# EAGLE design I2C Puppet (EAGLE 9.4.2)
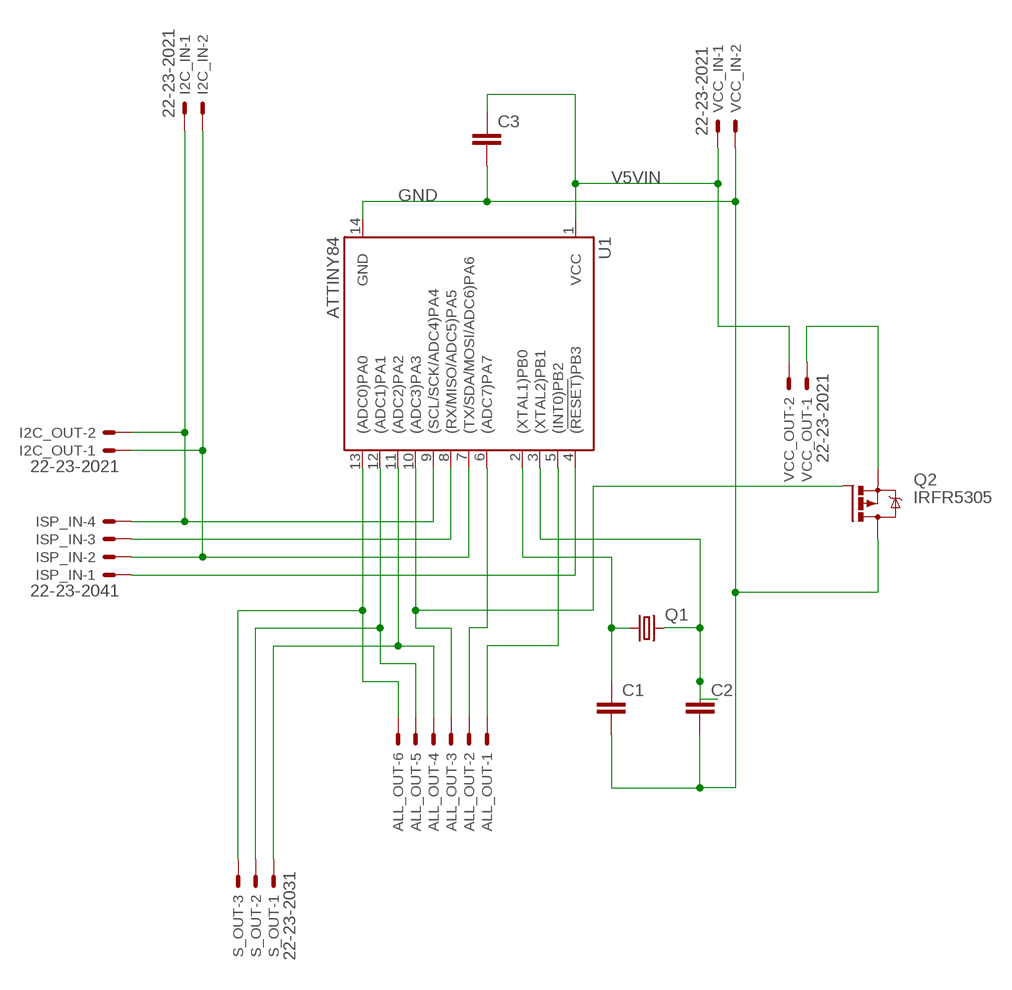
[diagram p0: schematic, sheet 1]

## Parts
ALL_OUT  22-23-2061  [22-23-2061]
C1  C-EUC1210  [C1210]
C2  C-EUC1210  [C1210]
C3  C-EUC1210  [C1210]
I2C_IN  22-23-2021  [22-23-2021]
I2C_OUT  22-23-2021  [22-23-2021]
ISP_IN  22-23-2041  [22-23-2041]
Q1  CRYSTALHC49UP  [HC49UP]
Q2  IRFR5305  [D-PAK_TO252AA]
S_OUT  22-23-2031  [22-23-2031]
U1  ATTINY84  [SO14]
VCC_IN  22-23-2021  [22-23-2021]
VCC_OUT  22-23-2021  [22-23-2021]

## Nets
GND: C1.2 C2.2 C3.2 Q2.4(D) U1.14(GND) VCC_IN.2
N$2: ALL_OUT.4 S_OUT.1 U1.11((ADC2)PA2)
N$3: I2C_IN.1 I2C_OUT.2 ISP_IN.4 U1.9((SCL/SCK/ADC4)PA4)
N$4: I2C_IN.2 I2C_OUT.1 ISP_IN.2 U1.7((TX/SDA/MOSI/ADC6)PA6)
N$5: C1.1 Q1.1 U1.2((XTAL1)PB0)
N$6: C2.1 Q1.2 U1.3((XTAL2)PB1)
N$7: ISP_IN.1 U1.4((!RESET!)PB3)
N$8: Q2.3(S) VCC_OUT.1
N$9: ISP_IN.3 U1.8((RX/MISO/ADC5)PA5)
N$11: ALL_OUT.6 S_OUT.3 U1.13((ADC0)PA0)
N$12: ALL_OUT.5 S_OUT.2 U1.12((ADC1)PA1)
N$13: ALL_OUT.3 Q2.1(G) U1.10((ADC3)PA3)
N$15: ALL_OUT.2 U1.6((ADC7)PA7)
N$16: ALL_OUT.1 U1.5((INT0)PB2)
V5VIN: C3.1 U1.1(VCC) VCC_IN.1 VCC_OUT.2

## Library data of the parts
ALL_OUT = con-molex:22-23-2061: .100" (2.54mm) Center Header - 6 Pin; MF: MOLEX; MPN: 22-23-2061; OC_FARNELL: 1462922; OC_NEWARK: 27C1933
C1-C3 = rcl:C-EU: CAPACITOR, European symbol; SPICEPREFIX: C
I2C_IN I2C_OUT VCC_IN VCC_OUT = con-molex:22-23-2021: .100" (2.54mm) Center Header - 2 Pin; MF: MOLEX; MPN: 22-23-2021; OC_FARNELL: 1462926; OC_NEWARK: 25C3832
ISP_IN = con-molex:22-23-2041: .100" (2.54mm) Center Header - 4 Pin; MF: MOLEX; MPN: 22-23-2041; OC_FARNELL: 1462920; OC_NEWARK: 38C0355
Q1 = adafruit:CRYSTAL: CRYSTAL; OC_FARNELL: unknown; OC_NEWARK: unknown
Q2 = transistor-power:IRF?5305: HEXFET Power MOSFET Source: http://www.irf.com/product-info/datasheets/data/irfr5305pbf.pdf
S_OUT = con-molex:22-23-2031: .100" (2.54mm) Center Header - 3 Pin; MF: MOLEX; MPN: 22-23-2031; OC_FARNELL: 1462950; OC_NEWARK: 30C0862
U1 = SparkFun-IC-Microcontroller:ATTINY84: Atmel 14-pin 2/4/8kB flash uC Datasheet <https://cdn.sparkfun.com/datasheets/Widgets/doc8006.pdf> SparkFun Products Tiny AVR Programmer <https://www.sparkfun.com/products/11801> (PGM-11801) SparkFun Servo Trigger - Continuous Rotation <https://www.sparkfun.com/products/13872> (WIG-13872) SparkFun Servo Trigger <https://www.sparkfun.com/products/13118> (WIG-13118); PROD_ID: IC-11285

## Board
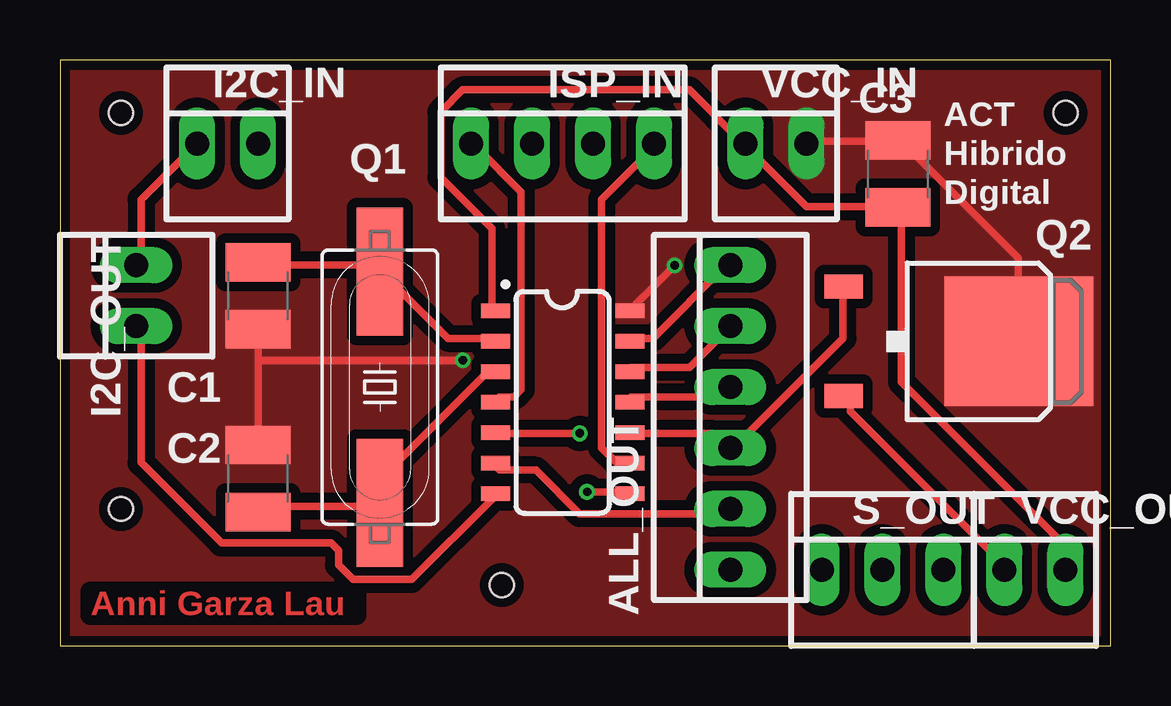
[diagram p1: board, top side]
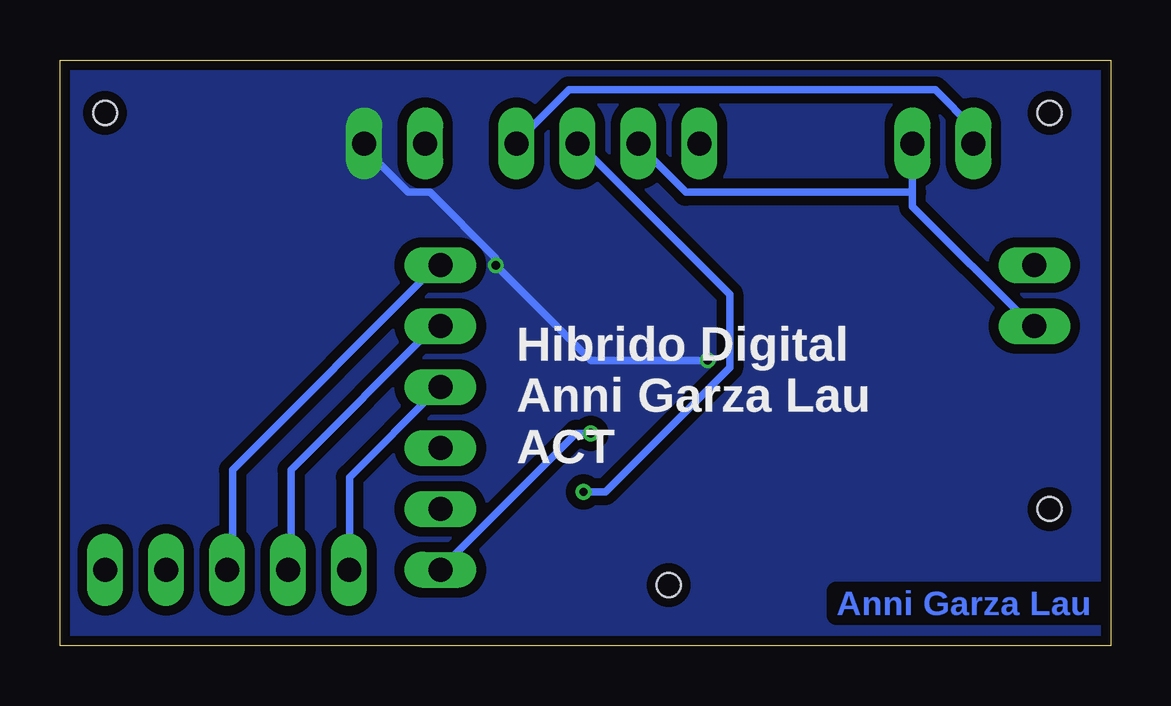
[diagram p2: board, bottom side, seen from below]

Size 43.8 x 24.43 mm. Coordinates in mm from the lower left corner, seen from the top.
Outline: 0,0 43.8,0 43.8,24.43 0,24.43 0,0
Copper layers (1*16): Top 0.035mm / dielectric 1.5mm / Bottom 0.035mm
Design rules "_xircuitos.mx_2L_DRC": minimum track width 6mil, minimum drill 12mil, track to track 6mil, track to pad 6mil, pad to pad 6mil, via to via 6mil, smd to smd 0mil, copper to edge 10mil, drill to drill 12mil, minimum pad ring 10mil, minimum via ring 6mil, stop-mask expansion 2mil, vias tented up to drill 100mil, thermal gap 10mil
Holes 1 mm at 2.54,22.23 41.91,22.23 18.41,2.54 2.54,5.71

### Footprints (pad centres in the part's own frame; a part is rotated, then mirrored left to right if it is on the bottom)
22-23-2061 = drill 1 long: 1 -6.35,0; 2 -3.81,0; 3 -1.27,0; 4 1.27,0; 5 3.81,0; 6 6.35,0
C1210 = smd 1.6 x 2.7: 1 -1.4,0; 2 1.4,0
22-23-2021 = drill 1 long: 1 -1.27,0; 2 1.27,0
22-23-2041 = drill 1 long: 1 -3.81,0; 2 -1.27,0; 3 1.27,0; 4 3.81,0
HC49UP = smd 5.334 x 1.93: 1 -4.826,0; 2 4.826,0
D-PAK_TO252AA = smd 1 x 1.6: 1 -2.28,-4.8; 3 2.28,-4.8 | smd 5.4 x 6.2: 4 0,2.5
22-23-2031 = drill 1 long: 1 -2.54,0; 2 0,0; 3 2.54,0
SO14 = smd 0.6 x 1.2: 1 -3.175,-2.8; 2 -1.905,-2.8; 3 -0.635,-2.8; 4 0.635,-2.8; 5 1.905,-2.8; 6 3.175,-2.8; 7 4.445,-2.8; 8 4.445,2.8; 9 3.175,2.8; 10 1.905,2.8; 11 0.635,2.8; 12 -0.635,2.8; 13 -1.905,2.8; 14 -3.175,2.8

### Placement (x,y rotation side)
ALL_OUT  27.94,9.53 90 top
C1  8.26,14.61 270 top
C2  8.26,6.99 90 top
C3  34.92,19.68 90 top
I2C_IN  6.99,20.95 0 top
I2C_OUT  3.17,14.61 90 top
ISP_IN  20.95,20.95 0 top
Q1  13.34,10.79 270 top
Q2  37.47,12.7 270 top
S_OUT  34.29,3.17 0 top
U1  20.95,10.79 270 top
VCC_IN  29.84,20.95 0 top
VCC_OUT  40.64,3.17 0 top

### Tracks (layer width: path | path; a pad name or v marks a point on that pad's centre or on a via)
GND  (via drill 0.35)
  Top 0.305: C1.2 8.26,11.91 | 8.26,11.91 C2.2 | v25.63,15.88 23.8,14.05 U1.14 | VCC_IN.2 31.11,21.06 34.77,21.06 C3.2 35.08,21.06 39.95,16.18 39.95,12.83 Q2.4 | v16.79,11.91 8.26,11.91
  Bottom 0.305: VCC_IN.2 31.11,20.75 29.29,18.92 28.37,18.92 25.63,16.18 v25.63,15.88 21.67,11.91 v16.79,11.91
  pour Bottom (isolate 0.406, no thermals): 0,0 43.81,0 43.81,24.77 0,24.77
  pour Top (isolate 0.406, no thermals): 0,0 0,24.77 43.81,24.77 43.81,0
N$2
  Top 0.305: U1.11 23.8,10.39 27.46,10.39 27.76,10.69 ALL_OUT.4
  Bottom 0.305: S_OUT.1 31.73,3.38 31.73,7.04 28.07,10.69 ALL_OUT.4
N$3
  Top 0.305: I2C_IN.1 3.38,18.62 3.38,15.88 I2C_OUT.2 | U1.9 23.5,7.64 23.19,7.64 22.58,8.26 22.58,18.62 24.71,20.75 ISP_IN.4
  Bottom 0.305: I2C_IN.1 5.71,21.59 7.32,23.19 22.58,23.19 24.71,21.06 ISP_IN.4
N$4
  Top 0.305: U1.7 18.01,6.12 14.66,2.77 12.22,2.77 11.61,3.38 11.61,3.99 11.3,4.29 6.73,4.29 3.38,7.64 3.38,13.13 I2C_OUT.1
  Bottom 0.305: 8.26,18.92 8.26,18.31 3.38,13.44 I2C_OUT.1 | 8.26,18.92 I2C_IN.2 | 8.26,18.92 17.7,18.92 19.53,20.75 ISP_IN.2
N$5
  Top 0.305: U1.2 18.01,12.83 16.18,12.83 13.44,15.57 Q1.1 13.13,15.88 8.26,15.88 C1.1
N$6
  Top 0.305: U1.3 18.01,11.3 17.7,11.3 13.44,7.04 13.44,6.12 Q1.2 13.13,5.82 8.26,5.82 C2.1
N$7
  Top 0.305: U1.4 18.31,10.39 18.92,10.39 19.23,10.69 19.23,18.92 17.4,20.75 ISP_IN.1
N$8
  Top 0.305: Q2.3 32.94,10.39 32.94,9.78 39.34,3.38 VCC_OUT.1
N$9  (via drill 0.35)
  Top 0.305: v21.97,6.43 23.5,6.43 U1.8
  Bottom 0.305: v21.97,6.43 21.06,6.43 15.88,11.61 15.88,14.66 21.97,20.75 ISP_IN.3
N$11
  Top 0.305: U1.13 23.8,12.83 24.71,12.83 27.76,15.88 ALL_OUT.6
  Bottom 0.305: S_OUT.3 36.6,3.38 36.6,7.34 28.07,15.88 ALL_OUT.6
N$12
  Top 0.305: U1.12 23.8,11.61 26.24,11.61 27.76,13.13 ALL_OUT.5
  Bottom 0.305: S_OUT.2 34.16,3.38 34.16,7.34 28.07,13.44 ALL_OUT.5
N$13
  Top 0.305: U1.10 23.8,8.87 27.15,8.87 27.76,8.26 ALL_OUT.3 28.07,8.26 32.64,12.83 32.64,14.96 Q2.1
N$15
  Top 0.305: U1.6 18.31,7.34 19.84,7.34 21.67,5.51 27.76,5.51 ALL_OUT.2
N$16  (via drill 0.35)
  Top 0.305: v21.67,8.87 18.31,8.87 U1.5
  Bottom 0.305: v21.67,8.87 22.28,8.87 27.76,3.38 ALL_OUT.1
V5VIN
  Top 0.305: U1.1 18.01,14.05 18.01,17.4 15.88,19.53 15.88,22.28 16.79,23.19 26.24,23.19 28.37,21.06 VCC_IN.1 28.68,20.75 31.11,18.31 34.77,18.31 C3.1 35.08,18.01 35.08,11 41.78,4.29 41.78,3.38 VCC_OUT.2

### Text on the board
Top: Anni Garza Lau
Bottom: Anni Garza Lau
tPlace: ACT / Hibrido / Digital
bPlace: Hibrido Digital / Anni Garza Lau / ACT